# Altium project breaker.PrjPcb (part 2 of 2)

## Sheet power.SchDoc
size A
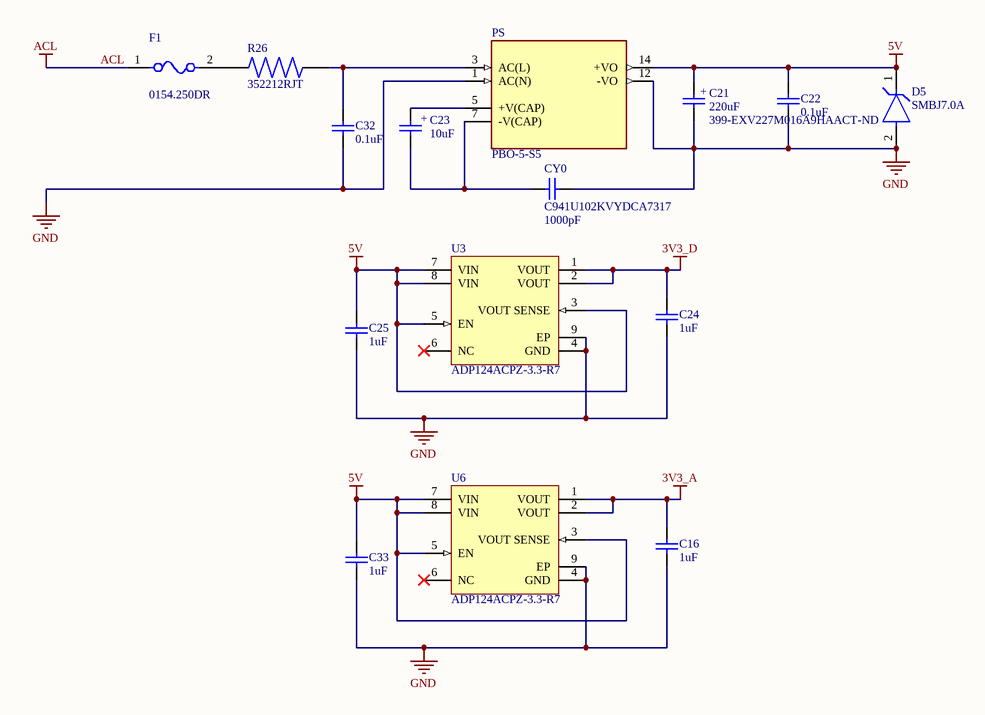
[diagram p3: power.SchDoc]

### Parts
C16  value 1uF  [0603C]  (hidden comment: 0603YD105MAT2A)
C21  value 220uF  Supplier Part Number 1: 399-EXV227M016A9HAACT-ND  [small_boi]  (hidden comment: EXV227M016A9HAA)
C22  value 0.1uF  [0603C]  (hidden comment: 06033C104K4T4A)
C23  value 10uF  [PCBComponent_1]  (hidden comment: MAL215299704E3)
C24  value 1uF  [0603C]  (hidden comment: 0603YD105MAT2A)
C25  value 1uF  [0603C]  (hidden comment: 0603YD105MAT2A)
C32  value 0.1uF  [1.083FILM]  (hidden comment: 104MKP275KC)
C33  value 1uF  [0603C]  (hidden comment: 0603YD105MAT2A)
CY0  C941U102KVYDCA7317  Capacitance: 1000pF  [MURA-DE1E3KX222MA5]
D5  SMBJ7.0A  [FP-SMBJ-MFG]
F1  0154.250DR  [FP-0154-MFG]
PS  PBO-5-S5  [CONV_PBO-5-S5]
R26  352212RJT  [RESC6332X120N]
U3  ADP124ACPZ-3.3-R7  [ADI-CP-8-8_V]
U6  ADP124ACPZ-3.3-R7  [ADI-CP-8-8_V]

### Nets
3V3_A: C16.2 U6.1(VOUT) U6.2(VOUT)
3V3_D: C24.2 U3.1(VOUT) U3.2(VOUT)
5V: C21.1 C22.2 C25.2 C33.2 D5.1(C) PS.14(+VO) U3.3(VOUT_SENSE) U3.5(EN) U3.7(VIN) U3.8(VIN) U6.3(VOUT_SENSE) U6.5(EN) U6.7(VIN) U6.8(VIN)
ACL: F1.1
GND: C16.1 C21.2 C22.1 C24.1 C25.1 C32.1 C33.1 CY0.2 D5.2(A) PS.1(AC(N)) PS.12(-VO) U3.4(GND) U3.9(EP) U6.4(GND) U6.9(EP)
NetC23_1: C23.1 PS.5(+V(CAP))
NetC23_2: C23.2 CY0.1 PS.7(-V(CAP))
NetC32_2: C32.2 PS.3(AC(L)) R26.2
NetF1_2: F1.2 R26.1

Not connected (* = marked no-connect by the designer): U3 6(NC)*; U6 6(NC)*

### Notes on the sheet
- (in symbol EXV227M016A9HAA) +
- (in symbol MAL215299704E3) +

### Library data of the parts
C16 C24 C25 C33 = 0603YD105MAT2A: AVX - 0603YD105MAT2A - Keramikvielschichtkondensator, SMD, 1 µF, 16 V, 0603 [Metrisch 1608], ± 20%, X5R, AVX 0603 MLCC; Manufacturer: Kyocera AVX; Voltage Rating (DC): 16V; Dissipation Factor: 3.5%; Supplier 2: Digi-Key; Manufacturer Part Number: 0603YD105MAT2A; RoHS: Yes; Category: Ceramic Capacitors; Stock 2: 32400; Pricing 2: 1=0.17000, 10=0.12100, 50=0.06880, 100=0.05700, 500=0.03998, 1000=0.03310 (USD); Mount: Surface Mount; Case/Package: 0603; Number of Pins: 2; Case Code (Metric): 1608; Case Code (Imperial): 0603; Min Operating Temperature: -55°C; Max Operating Temperature: 85°C; Capacitance: 1uF; Tolerance: 20%; Dielectric: X5R; Packaging: Tape and Reel; Voltage Rating: 16V; Package Quantity: 4000; Termination: SMD/SMT; Series: -; Construction: Flat; Length: 1.6mm; Width: 0.032inch; Height: 0.9mm; Depth: 0.81mm; Thickness: 0.035inch; Radiation Hardening: No; REACH SVHC: No SVHC; Lead Free: Lead Free; RoHS Compliant: Yes; ComponentLink1URL: https://datasheet.ciiva.com/151/cx5r-151029.pdf?src-supplier=Digi-Key; ComponentLink1Description: https://datasheet.ciiva.com/151/cx5r-151029.pdf?src-supplier=Digi-Key; ComponentLink2URL: https://datasheet.ciiva.com/151/cx5r-151030.pdf?src-supplier=Digi-Key; ComponentLink2Description: https://datasheet.ciiva.com/151/cx5r-151030.pdf?src-supplier=Digi-Key; ComponentLink3URL: https://datasheet.ciiva.com/151/cx5r-151031.pdf?src-supplier=Digi-Key; ComponentLink3Description: https://datasheet.ciiva.com/151/cx5r-151031.pdf?src-supplier=Digi-Key; ComponentLink4URL: https://datasheet.ciiva.com/22682/1666675-22682860.pdf?src-supplier=Element14; ComponentLink4Description: https://datasheet.ciiva.com/22682/1666675-22682860.pdf?src-supplier=Element14; ComponentLink5URL: https://datasheet.ciiva.com/28586/1666675-28586031.pdf?src-supplier=Element14; ComponentLink5Description: https://datasheet.ciiva.com/28586/1666675-28586031.pdf?src-supplier=Element14; Supplier Part Number 1: 478-5319-1-ND
C21 = EXV227M016A9HAA: Aluminum electrolytic capacitor, 220uF, 16V; Manufacturer: KEMET; Manufacturer Part Number: C0603C103K3TACAUTO; RoHS: No; Stock 2: 10862; Pricing 2: 1=0.45000, 10=0.31800, 50=0.24080, 100=0.20970, 500=0.15532, 1000=0.13202 (USD)
C22 = 06033C104K4T4A: Cap Ceramic 0.1uF 25V X7R 10% Pad SMD 0603 125C Automotive T/R; Manufacturer: Kyocera AVX; Capacitance: 100nF; Supplier Part Number 1: 478-10673-1-ND; Supplier 2: Digi-Key; Manufacturer Part Number: 06033C104K4T4A; RoHS: Yes; Category: Ceramic Capacitors; Stock 2: 4996; Pricing 2: 1=0.15000, 10=0.11000, 50=0.06220, 100=0.05150, 500=0.03612, 1000=0.02991, 2500=0.02784, 5000=0.02547 (USD); Mount: Surface Mount; Case/Package: 0603; Min Operating Temperature: -55°C; Max Operating Temperature: 125°C; Tolerance: 10%; Packaging: Tape and Reel; Dielectric: X7R; Voltage Rating (DC): 25V; Construction: Flat; Length: 1.6mm; Depth: 0.81mm; ComponentLink1URL: https://datasheet.ciiva.com/11503/cauto-11503964.pdf?src-supplier=Avnet; ComponentLink1Description: https://datasheet.ciiva.com/11503/cauto-11503964.pdf?src-supplier=Avnet
C23 = MAL215299704E3: Aluminum Electrolitic Capacitor, 10uF, 450Vac; Manufacturer: KEMET; Manufacturer Part Number: C0603C103K3TACAUTO; RoHS: No; Stock 2: 10862; Pricing 2: 1=0.45000, 10=0.31800, 50=0.24080, 100=0.20970, 500=0.15532, 1000=0.13202 (USD); Supplier Part Number 1: 56-MAL215299704E3CT-ND
C32 = 104MKP275KC: Capacitor; Manufacturer: KEMET; Manufacturer Part Number: C0603C103K3TACAUTO; Supplier 2: Digi-Key; RoHS: No; Stock 2: 10862; Pricing 2: 1=0.45000, 10=0.31800, 50=0.24080, 100=0.20970, 500=0.15532, 1000=0.13202 (USD); Supplier Part Number 1: 399-C0603C103K3TACAUTOCT-ND
CY0 = CMP-2000-06146-1: Ceramic Capacitor, 2.2 nF, +/- 20%, 250 V, -25 to 85 degC, 2-Pin THD, RoHS, Bulk; Manufacturer: Murata; Capacitor Case Style: Disc; Body Diameter: 12mm; Capacitor Application: Safety/Suppression; Voltage Rating: 250VAC; Dielectric Characteristic: E; Lead Length: 25mm; External Width: 10mm; SVHC: NoSVHC(19-Dec-2012); Suppression Class: X1/Y1; Proof Voltage: 4000V; Capacitor Terminals: RadialLeaded; No. of Pins: 2; Voltage Rating V AC: 250V; Operating Temperature Min: -25°C; Series: KX; Lead Spacing: 10mm; Package Description: 2-Pin Through Hole Device, Radial, Dia 10 mm, Heigh 14 mm; Datasheet URL: http://www.murata.com/~/media/webrenewal/campaign/ads/america/amr_ami/c85e.ashx?la=en-us; Datasheet Version: 04/2014; Tolerance -: 20%; Tolerance +: 20%; Mounting Technology: ThroughHole; Capacitance Tolerance: ±20%; Manufacturer URL: http://www.murata.com/; Operating Temperature Max: 125°C; Package Reference: DE1E3KX222MA5; Operating Temperature Range: -25°Cto+125°C
D5 = CMP-08607-000042-1: TVS DIODE 5V 9.2V DO214AA; Manufacturer: Littelfuse Inc; Manufacturer Part Number: SMBJ5.0A; Breakdown Voltage: 6.4V; Direction: Unidirectional; Peak Pulse Current: 65.3A; Max Junction Temp: +150°C; Number Of Channels: 1; Peak Pulse Power: 600W; Clamping Voltage: 9.2V; Octopart: https://octopart.com/smbj5.0a-littelfuse-8835; Package: SMBJ; RoHS: TRUE; Temperature Range Low: -65°C; Device Class L2: TVS Diodes; Automotive: No; ComponentLink2URL: https://www.littelfuse.com/~/media/electronics/datasheets/tvs_diodes/littelfuse_tvs_diode_smbj_datasheet.pdf.pdf; Height: 2.61mm; ComponentLink2Description: Datasheet; Temperature: -65°C to +150°C; Category: Diode; Temperature Range High: +150°C; Lead Free: Yes; Digikey Description: TVS DIODE 5V 9.2V DO214AA; Device Class L1: Circuit Protection; Reverse Standoff Voltage: 5V; Device Class L3: unset; Mouser Description: TVSS; Diode; For Data/Comm; Industrial Equip; 65.3A; SMD; Solder Term; Clamp-V 9.2V
F1 = CMP-08605-000036-1: FUSE BOARD MNT 250MA 125VAC/VDC; Manufacturer: Littelfuse; Fuse Blow Speed: Fast; Fuse I2T: 0.0113A2Sec; Voltage Rating: 125V; Fuse Current: 0.25A; ComponentLink2URL: https://www.littelfuse.com/~/media/electronics/datasheets/fuses/littelfuse_fuse_154_154t_154l_154tl_datasheet.pdf.pdf; Category: Fuse; Device Class L1: Circuit Protection; Manufacturer Part Number: 0154.250DR; Mouser Description: Surface Mount Fuses Fuseblck w/ fuse.25A OMNI BLOK 154; Device Class L3: unset; Package: 0154; ComponentLink2Description: Datasheet; Temperature Range Low: -55°C; Max Fuse Dc Voltage: 125V; Temperature Range High: +125°C; Temperature: -55°C to +125°C; Device Class L2: Fuses; Max Fuse Ac Voltage: 125V; Lead Free: Yes; RoHS: TRUE; Digikey Description: FUSE BOARD MNT 250MA 125VAC/VDC; Height: 3.81mm; Automotive: No; Octopart: https://octopart.com/0154.250dr-littelfuse-565851
PS = PBO-5-S5: 5 W, Single Output, Open Frame, Board Mount, Ac-Dc Power Supply; MF: CUI Inc.; Package: SIP-14; Value: *; MP: PBO-5-S5; Availability: Unavailable; SnapEDA_Link: https://www.snapeda.com/parts/PBO-5-S5/CUI/view-part/2859892/?ref=snap; Price: None
R26 = 352212RJT: Thick Film Resistors - SMD 3522 12R 5% 3W; MF: TE Connectivity; Resistance: 12; Package: 2512; Availability: Unavailable; SnapEDA_Link: https://www.snapeda.com/parts/352212RJT/TE%20Connectivity%20Passive%20Product/view-part/1008159/?ref=snap; MP: 352212RJT; Value: *; Price: None; Mouser-Purchase-URL: https://snapeda.com/shop?store=Mouser&id=1008159; Power_Rating: 3 W; Tolerance: 5%
U3 U6 = CMP-0786-00127-1: 500 mA, Low Quiescent Current, CMOS Linear Regulator, 2.3 to 5.5 V Vin, 3.3 V Vout, Industrial, 8-pin SON (CP-8-8), Reel; Manufacturer: Analog Devices; Iout max: 500mA; Preset Vout Values (V): 3.3; Supply Current IGND @ Small Load: 45uA; Vin (min) (V): 2.3; Vin (max) (V): 5.5; Mounting Technology: Surface Mount; PackageVersion: 101028-A, 10/2008; ComponentLink3URL: http:/www.analog.com/static/imported-files/packages/PKG_PDF/LFCSP(CP)/CP_8_8.pdf; DatasheetVersion: Rev. C; ComponentLink1Description: Manufacturer URL; PartNumber: ADP124ACPZ-3.3-R7; ComponentLink2Description: Datasheet; ComponentLink4URL: Product URL:http://www.analog.com/en/ADP124/productSearch.html; ComponentLink1URL: http://www.analog.com/en/index.html; PackageReference: CP-8-8; ComponentLink2URL: http://www.analog.com/static/imported-files/data_sheets/ADP124_125.pdf; ComponentLink4Description: URL Link1; PackageDescription: 8-Pin Lead Frame Chip Scale Package, Body 2 x 2 mm, Pitch 0.5 mm; Packing: Reel; ComponentLink3Description: Package Specification

## Nets that join several sheets
3V3_A: controller (7 pins), circuit_breaker (5 pins), power (C16.2 U6.1 U6.2)
3V3_D: controller (18 pins), power (C24.2 U3.1 U3.2)
5V: circuit_breaker (D7.1 K1.8), power (14 pins)
ACL: circuit_breaker (J2.1 K1.3 K1.6), power (F1.1)
GND: controller (31 pins), circuit_breaker (15 pins), power (15 pins)
FAULT_ISR: controller (U1.13 U5.3), circuit_breaker (U4.8)
NetC15_2: controller (C15.2 R6.1 R8.1), circuit_breaker (U4.9)
NetC28_1: controller (R1.2), circuit_breaker (C28.1 C29.2 R18.2 U4.1)
NetR7_2: controller (R7.2), circuit_breaker (U4.13 U4.14)
RELAY_ON: controller (U1.12), circuit_breaker (Q1.1 R30.2)